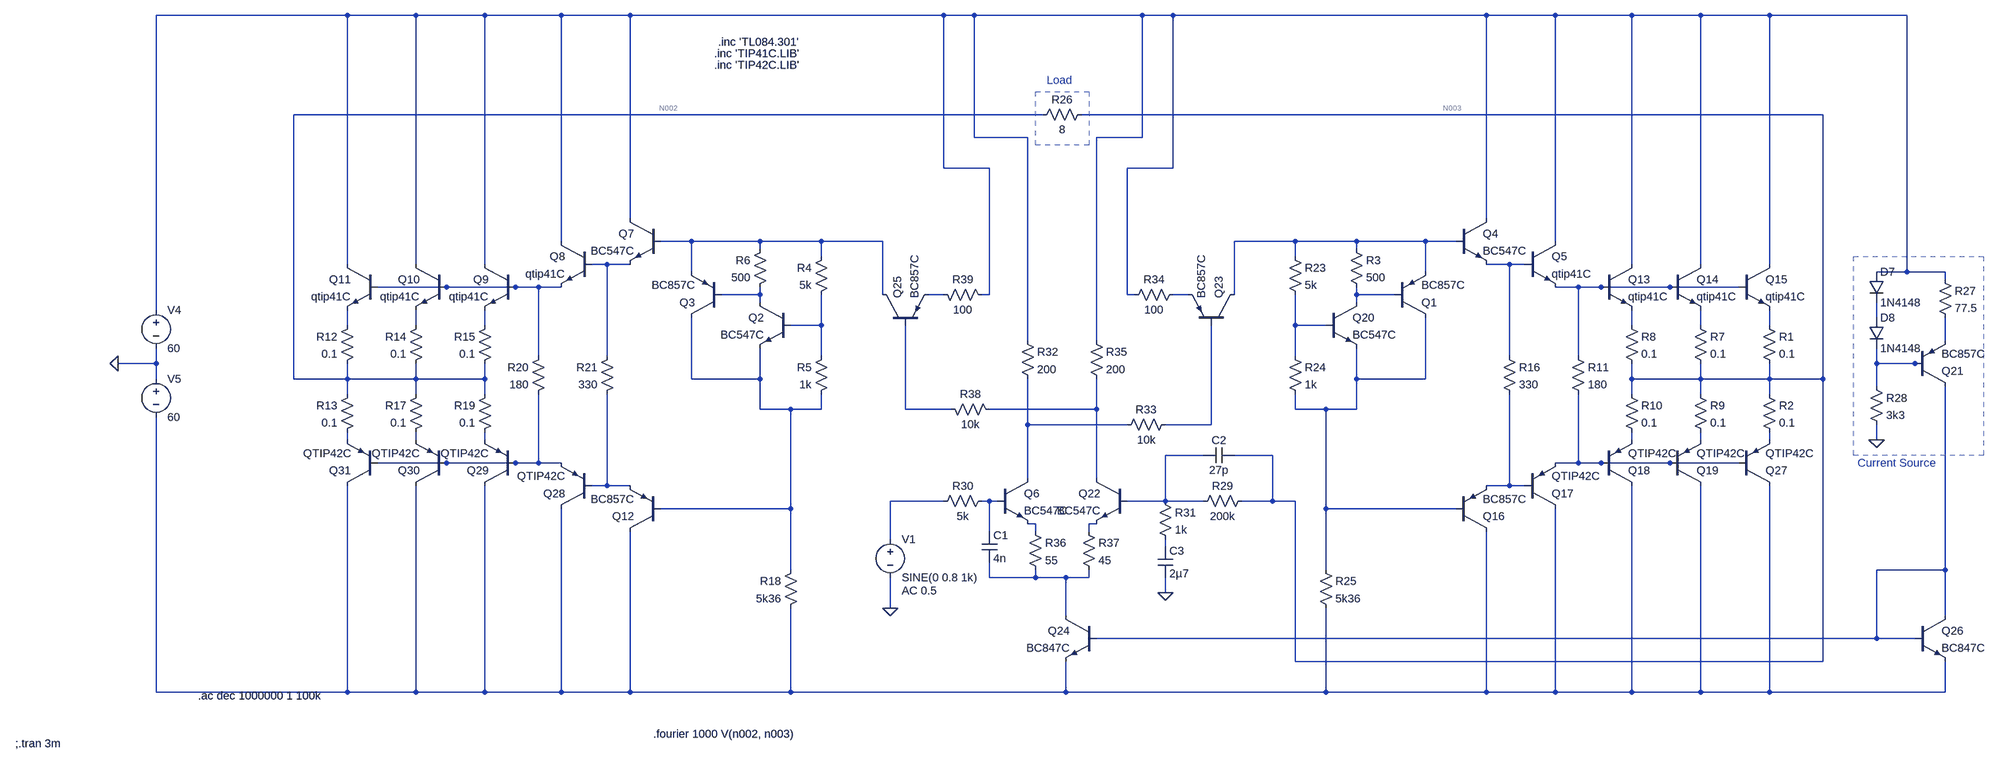
[diagram p0: schematic V3.asc]
V3.asc, the LTspice schematic file:
Version 4
SHEET 1 2416 748
WIRE -1344 -800 -1744 -800
WIRE -1200 -800 -1344 -800
WIRE -1056 -800 -1200 -800
WIRE -896 -800 -1056 -800
WIRE -752 -800 -896 -800
WIRE -96 -800 -752 -800
WIRE -32 -800 -96 -800
WIRE 320 -800 -32 -800
WIRE 384 -800 320 -800
WIRE 1040 -800 384 -800
WIRE 1184 -800 1040 -800
WIRE 1344 -800 1184 -800
WIRE 1488 -800 1344 -800
WIRE 1632 -800 1488 -800
WIRE 1920 -800 1632 -800
WIRE 112 -592 -1456 -592
WIRE 1744 -592 192 -592
WIRE -32 -544 -32 -800
WIRE 80 -544 -32 -544
WIRE 320 -544 320 -800
WIRE 320 -544 224 -544
WIRE -96 -480 -96 -800
WIRE 0 -480 -96 -480
WIRE 384 -480 384 -800
WIRE 384 -480 288 -480
WIRE -752 -368 -752 -800
WIRE 1040 -368 1040 -800
WIRE -896 -320 -896 -800
WIRE -624 -320 -688 -320
WIRE -480 -320 -624 -320
WIRE -352 -320 -480 -320
WIRE -224 -320 -352 -320
WIRE 640 -320 512 -320
WIRE 768 -320 640 -320
WIRE 912 -320 768 -320
WIRE 976 -320 912 -320
WIRE 1184 -320 1184 -800
WIRE -480 -304 -480 -320
WIRE 768 -304 768 -320
WIRE -352 -288 -352 -320
WIRE 640 -288 640 -320
WIRE -1344 -272 -1344 -800
WIRE -1200 -272 -1200 -800
WIRE -1056 -272 -1056 -800
WIRE -800 -272 -832 -272
WIRE -752 -272 -800 -272
WIRE 1088 -272 1040 -272
WIRE 1120 -272 1088 -272
WIRE 1344 -272 1344 -800
WIRE 1488 -272 1488 -800
WIRE 1632 -272 1632 -800
WIRE -624 -256 -624 -320
WIRE 912 -256 912 -320
WIRE 1920 -256 1920 -800
WIRE 1920 -256 1856 -256
WIRE 2000 -256 1920 -256
WIRE 2000 -240 2000 -256
WIRE -1136 -224 -1280 -224
WIRE -992 -224 -1136 -224
WIRE -944 -224 -992 -224
WIRE -896 -224 -944 -224
WIRE 1232 -224 1184 -224
WIRE 1280 -224 1232 -224
WIRE 1424 -224 1280 -224
WIRE 1568 -224 1424 -224
WIRE -480 -208 -480 -224
WIRE -480 -208 -560 -208
WIRE -224 -208 -224 -320
WIRE -96 -208 -128 -208
WIRE 0 -208 0 -480
WIRE 0 -208 -16 -208
WIRE 288 -208 288 -480
WIRE 304 -208 288 -208
WIRE 416 -208 384 -208
WIRE 512 -208 512 -320
WIRE 768 -208 768 -224
WIRE 848 -208 768 -208
WIRE -480 -192 -480 -208
WIRE 768 -192 768 -208
WIRE -1744 -176 -1744 -800
WIRE 1856 -160 1856 -192
WIRE -1344 -144 -1344 -176
WIRE -1200 -144 -1200 -176
WIRE -1056 -144 -1056 -176
WIRE -352 -144 -352 -208
WIRE -352 -144 -416 -144
WIRE 640 -144 640 -208
WIRE 704 -144 640 -144
WIRE 1344 -144 1344 -176
WIRE 1488 -144 1488 -176
WIRE 1632 -144 1632 -176
WIRE 80 -112 80 -544
WIRE 224 -112 224 -544
WIRE 2000 -112 2000 -160
WIRE -944 -80 -944 -224
WIRE -800 -80 -800 -272
WIRE -352 -80 -352 -144
WIRE 640 -80 640 -144
WIRE 1088 -80 1088 -272
WIRE 1232 -80 1232 -224
WIRE -1744 -64 -1744 -96
WIRE -1744 -64 -1824 -64
WIRE 1856 -64 1856 -96
WIRE 1936 -64 1856 -64
WIRE 1952 -64 1936 -64
WIRE -1744 -32 -1744 -64
WIRE -1456 -32 -1456 -592
WIRE -1344 -32 -1344 -64
WIRE -1344 -32 -1456 -32
WIRE -1200 -32 -1200 -64
WIRE -1200 -32 -1344 -32
WIRE -1056 -32 -1056 -64
WIRE -1056 -32 -1200 -32
WIRE -624 -32 -624 -160
WIRE -480 -32 -480 -96
WIRE -480 -32 -624 -32
WIRE 768 -32 768 -96
WIRE 912 -32 912 -160
WIRE 912 -32 768 -32
WIRE 1344 -32 1344 -64
WIRE 1488 -32 1488 -64
WIRE 1488 -32 1344 -32
WIRE 1632 -32 1632 -64
WIRE 1632 -32 1488 -32
WIRE 1744 -32 1744 -592
WIRE 1744 -32 1632 -32
WIRE 1856 -16 1856 -64
WIRE -1344 0 -1344 -32
WIRE -1200 0 -1200 -32
WIRE -1056 0 -1056 -32
WIRE 1344 0 1344 -32
WIRE 1488 0 1488 -32
WIRE 1632 0 1632 -32
WIRE -480 32 -480 -32
WIRE -416 32 -480 32
WIRE -352 32 -352 0
WIRE -352 32 -416 32
WIRE -176 32 -176 -144
WIRE -80 32 -176 32
WIRE 224 32 224 -32
WIRE 224 32 0 32
WIRE 640 32 640 0
WIRE 704 32 640 32
WIRE 768 32 768 -32
WIRE 768 32 704 32
WIRE 80 64 80 -32
WIRE 288 64 80 64
WIRE 464 64 464 -144
WIRE 464 64 368 64
WIRE -1344 96 -1344 80
WIRE -1200 96 -1200 80
WIRE -1056 96 -1056 80
WIRE 1344 96 1344 80
WIRE 1488 96 1488 80
WIRE 1632 96 1632 80
WIRE 1856 96 1856 64
WIRE 448 128 368 128
WIRE 592 128 512 128
WIRE -1136 144 -1280 144
WIRE -992 144 -1136 144
WIRE -944 144 -944 0
WIRE -944 144 -992 144
WIRE -896 144 -944 144
WIRE 1232 144 1232 0
WIRE 1232 144 1184 144
WIRE 1280 144 1232 144
WIRE 1424 144 1280 144
WIRE 1568 144 1424 144
WIRE 80 176 80 64
WIRE 224 176 224 32
WIRE -800 192 -800 0
WIRE -800 192 -832 192
WIRE -752 192 -800 192
WIRE 1088 192 1088 0
WIRE 1088 192 1040 192
WIRE 1120 192 1088 192
WIRE -96 224 -208 224
WIRE 0 224 -16 224
WIRE 16 224 0 224
WIRE 368 224 368 128
WIRE 368 224 288 224
WIRE 448 224 368 224
WIRE 592 224 592 128
WIRE 592 224 528 224
WIRE 640 224 592 224
WIRE -416 240 -416 32
WIRE -416 240 -688 240
WIRE 704 240 704 32
WIRE 976 240 704 240
WIRE 96 272 80 272
WIRE 224 272 208 272
WIRE 0 288 0 224
WIRE 96 288 96 272
WIRE 208 288 208 272
WIRE -208 304 -208 224
WIRE 368 320 368 304
WIRE -416 368 -416 240
WIRE 704 368 704 240
WIRE 2000 368 2000 -16
WIRE 2000 368 1856 368
WIRE 0 384 0 352
WIRE 96 384 96 368
WIRE 96 384 0 384
WIRE 160 384 96 384
WIRE 208 384 208 368
WIRE 208 384 160 384
WIRE 368 416 368 384
WIRE -208 448 -208 384
WIRE 160 464 160 384
WIRE 2000 464 2000 368
WIRE 1856 512 1856 368
WIRE 1856 512 224 512
WIRE 1936 512 1856 512
WIRE 640 560 640 224
WIRE 1744 560 1744 -32
WIRE 1744 560 640 560
WIRE -1744 624 -1744 48
WIRE -1344 624 -1344 192
WIRE -1344 624 -1744 624
WIRE -1200 624 -1200 192
WIRE -1200 624 -1344 624
WIRE -1056 624 -1056 192
WIRE -1056 624 -1200 624
WIRE -896 624 -896 240
WIRE -896 624 -1056 624
WIRE -752 624 -752 288
WIRE -752 624 -896 624
WIRE -416 624 -416 448
WIRE -416 624 -752 624
WIRE 160 624 160 560
WIRE 160 624 -416 624
WIRE 704 624 704 448
WIRE 704 624 160 624
WIRE 1040 624 1040 288
WIRE 1040 624 704 624
WIRE 1184 624 1184 240
WIRE 1184 624 1040 624
WIRE 1344 624 1344 192
WIRE 1344 624 1184 624
WIRE 1488 624 1488 192
WIRE 1488 624 1344 624
WIRE 1632 624 1632 192
WIRE 1632 624 1488 624
WIRE 2000 624 2000 560
WIRE 2000 624 1632 624
FLAG 1856 96 0
FLAG -1824 -64 0
FLAG -208 448 0
FLAG 368 416 0
SYMBOL res -400 352 M0
SYMATTR InstName R18
SYMATTR Value 5k36
SYMBOL npn 704 -192 R0
SYMATTR InstName Q20
SYMATTR Value BC547C
SYMBOL res 624 -304 R0
SYMATTR InstName R23
SYMATTR Value 5k
SYMBOL res 624 -96 R0
SYMATTR InstName R24
SYMATTR Value 1k
SYMBOL res 688 352 R0
SYMATTR InstName R25
SYMATTR Value 5k36
SYMBOL res 208 -608 R90
WINDOW 0 0 56 VBottom 2
WINDOW 3 32 56 VTop 2
SYMATTR InstName R26
SYMATTR Value 8
SYMBOL pnp 1936 -16 M180
SYMATTR InstName Q21
SYMATTR Value BC857C
SYMBOL res 1984 -256 R0
SYMATTR InstName R27
SYMATTR Value 77.5
SYMBOL res 1840 -32 R0
SYMATTR InstName R28
SYMATTR Value 3k3
SYMBOL diode 1840 -256 R0
SYMATTR InstName D7
SYMATTR Value 1N4148
SYMBOL diode 1840 -160 R0
SYMATTR InstName D8
SYMATTR Value 1N4148
SYMBOL voltage -1744 -192 R0
WINDOW 123 0 0 Left 0
WINDOW 39 24 44 Left 2
SYMATTR InstName V4
SYMATTR Value 60
SYMBOL voltage -1744 -48 R0
WINDOW 123 0 0 Left 0
WINDOW 39 24 124 Left 2
SYMATTR InstName V5
SYMATTR Value 60
SYMBOL npn 16 176 R0
SYMATTR InstName Q6
SYMATTR Value BC547C
SYMBOL npn 288 176 M0
SYMATTR InstName Q22
SYMATTR Value BC547C
SYMBOL res 544 208 R90
WINDOW 0 0 56 VBottom 2
WINDOW 3 32 56 VTop 2
SYMATTR InstName R29
SYMATTR Value 200k
SYMBOL res 0 208 R90
WINDOW 0 0 56 VBottom 2
WINDOW 3 32 56 VTop 2
SYMATTR InstName R30
SYMATTR Value 5k
SYMBOL res 352 208 R0
SYMATTR InstName R31
SYMATTR Value 1k
SYMBOL res 64 -128 R0
SYMATTR InstName R32
SYMATTR Value 200
SYMBOL pnp 512 -144 M270
SYMATTR InstName Q23
SYMATTR Value BC857C
SYMBOL res 384 48 R90
WINDOW 0 0 56 VBottom 2
WINDOW 3 32 56 VTop 2
SYMATTR InstName R33
SYMATTR Value 10k
SYMBOL res 288 -192 R270
WINDOW 0 32 56 VTop 2
WINDOW 3 0 56 VBottom 2
SYMATTR InstName R34
SYMATTR Value 100
SYMBOL npn 224 464 M0
SYMATTR InstName Q24
SYMATTR Value BC847C
SYMBOL res 208 -128 R0
SYMATTR InstName R35
SYMATTR Value 200
SYMBOL res 80 272 R0
SYMATTR InstName R36
SYMATTR Value 55
SYMBOL res 192 272 R0
SYMATTR InstName R37
SYMATTR Value 45
SYMBOL voltage -208 288 R0
WINDOW 123 24 124 Left 2
WINDOW 39 0 0 Left 0
SYMATTR Value2 AC 0.5
SYMATTR InstName V1
SYMATTR Value SINE(0 0.8 1k)
SYMBOL pnp -224 -144 R270
SYMATTR InstName Q25
SYMATTR Value BC857C
SYMBOL res -96 16 M90
WINDOW 0 0 56 VBottom 2
WINDOW 3 32 56 VTop 2
SYMATTR InstName R38
SYMATTR Value 10k
SYMBOL res 0 -192 M270
WINDOW 0 32 56 VTop 2
WINDOW 3 0 56 VBottom 2
SYMATTR InstName R39
SYMATTR Value 100
SYMBOL npn 1936 464 R0
SYMATTR InstName Q26
SYMATTR Value BC847C
SYMBOL cap -16 288 R0
SYMATTR InstName C1
SYMATTR Value 4n
SYMBOL cap 512 112 R90
WINDOW 0 0 32 VBottom 2
WINDOW 3 32 32 VTop 2
SYMATTR InstName C2
SYMATTR Value 27p
SYMBOL cap 352 320 R0
SYMATTR InstName C3
SYMATTR Value 2µ7
SYMBOL res 752 -320 R0
SYMATTR InstName R3
SYMATTR Value 500
SYMBOL pnp 848 -160 M180
SYMATTR InstName Q1
SYMATTR Value BC857C
SYMBOL npn -416 -192 M0
SYMATTR InstName Q2
SYMATTR Value BC547C
SYMBOL res -336 -304 M0
SYMATTR InstName R4
SYMATTR Value 5k
SYMBOL res -336 -96 M0
SYMATTR InstName R5
SYMATTR Value 1k
SYMBOL res -464 -320 M0
SYMATTR InstName R6
SYMATTR Value 500
SYMBOL pnp -560 -160 R180
SYMATTR InstName Q3
SYMATTR Value BC857C
SYMBOL npn 976 -368 R0
SYMATTR InstName Q4
SYMATTR Value BC547C
SYMBOL npn 1120 -320 R0
SYMATTR InstName Q5
SYMATTR Value qtip41C
SYMBOL npn 1280 -272 R0
SYMATTR InstName Q13
SYMATTR Value qtip41C
SYMBOL npn 1424 -272 R0
SYMATTR InstName Q14
SYMATTR Value qtip41C
SYMBOL npn 1568 -272 R0
SYMATTR InstName Q15
SYMATTR Value qtip41C
SYMBOL pnp 976 288 M180
SYMATTR InstName Q16
SYMATTR Value BC857C
SYMBOL pnp 1120 240 M180
SYMATTR InstName Q17
SYMATTR Value QTIP42C
SYMBOL pnp 1280 192 M180
SYMATTR InstName Q18
SYMATTR Value QTIP42C
SYMBOL pnp 1424 192 M180
SYMATTR InstName Q19
SYMATTR Value QTIP42C
SYMBOL pnp 1568 192 M180
SYMATTR InstName Q27
SYMATTR Value QTIP42C
SYMBOL res 1616 -160 R0
SYMATTR InstName R1
SYMATTR Value 0.1
SYMBOL res 1616 -16 R0
SYMATTR InstName R2
SYMATTR Value 0.1
SYMBOL res 1472 -160 R0
SYMATTR InstName R7
SYMATTR Value 0.1
SYMBOL res 1328 -160 R0
SYMATTR InstName R8
SYMATTR Value 0.1
SYMBOL res 1472 -16 R0
SYMATTR InstName R9
SYMATTR Value 0.1
SYMBOL res 1328 -16 R0
SYMATTR InstName R10
SYMATTR Value 0.1
SYMBOL res 1216 -96 R0
SYMATTR InstName R11
SYMATTR Value 180
SYMBOL res 1072 -96 R0
SYMATTR InstName R16
SYMATTR Value 330
SYMBOL npn -688 -368 M0
SYMATTR InstName Q7
SYMATTR Value BC547C
SYMBOL npn -832 -320 M0
SYMATTR InstName Q8
SYMATTR Value qtip41C
SYMBOL npn -992 -272 M0
SYMATTR InstName Q9
SYMATTR Value qtip41C
SYMBOL npn -1136 -272 M0
SYMATTR InstName Q10
SYMATTR Value qtip41C
SYMBOL npn -1280 -272 M0
SYMATTR InstName Q11
SYMATTR Value qtip41C
SYMBOL pnp -688 288 R180
SYMATTR InstName Q12
SYMATTR Value BC857C
SYMBOL pnp -832 240 R180
SYMATTR InstName Q28
SYMATTR Value QTIP42C
SYMBOL pnp -992 192 R180
SYMATTR InstName Q29
SYMATTR Value QTIP42C
SYMBOL pnp -1136 192 R180
SYMATTR InstName Q30
SYMATTR Value QTIP42C
SYMBOL pnp -1280 192 R180
SYMATTR InstName Q31
SYMATTR Value QTIP42C
SYMBOL res -1328 -160 M0
SYMATTR InstName R12
SYMATTR Value 0.1
SYMBOL res -1328 -16 M0
SYMATTR InstName R13
SYMATTR Value 0.1
SYMBOL res -1184 -160 M0
SYMATTR InstName R14
SYMATTR Value 0.1
SYMBOL res -1040 -160 M0
SYMATTR InstName R15
SYMATTR Value 0.1
SYMBOL res -1184 -16 M0
SYMATTR InstName R17
SYMATTR Value 0.1
SYMBOL res -1040 -16 M0
SYMATTR InstName R19
SYMATTR Value 0.1
SYMBOL res -928 -96 M0
SYMATTR InstName R20
SYMATTR Value 180
SYMBOL res -784 -96 M0
SYMATTR InstName R21
SYMATTR Value 330
TEXT -568 -744 Left 2 !.inc 'TL084.301'
TEXT 1816 144 Left 2 ;Current Source
TEXT -576 -720 Left 2 !.inc 'TIP41C.LIB'
TEXT -1656 632 Left 2 !.ac dec 1000000 1 100k
TEXT -704 712 Left 2 !.fourier 1000 V(n002, n003)
TEXT -2122 732 Left 2 !;.tran 3m
TEXT -576 -696 Left 2 !.inc 'TIP42C.LIB'
TEXT 120 -664 Left 2 ;Load
RECTANGLE Normal 2080 128 1808 -288 2
RECTANGLE Normal 208 -528 96 -640 2

The netlist it stands for:
* V3.asc
R18 N025 N049 5k36
Q20 N013 N019 N026 0 BC547C
R23 N005 N019 5k
R24 N019 N026 1k
R25 N026 N049 5k36
R26 N003 N002 8
Q21 N047 N024 N023 0 BC857C
R27 N001 N023 77.5
R28 N024 0 3k3
D7 N001 N014 1N4148
D8 N014 N024 1N4148
V4 N001 0 60
V5 0 N049 60
Q6 N029 N043 N044 0 BC547C
Q22 N028 N037 N045 0 BC547C
R29 N003 N037 200k
R30 N043 N042 5k
R31 N037 N046 1k
R32 N001 N029 200
Q23 N005 N030 N012 0 BC857C
R33 N030 N029 10k
R34 N001 N012 100
Q24 N048 N047 N049 0 BC847C
R35 N001 N028 200
R36 N044 N048 55
R37 N045 N048 45
V1 N042 0 SINE(0 0.8 1k) AC 0.5
Q25 N004 N027 N011 0 BC857C
R38 N027 N028 10k
R39 N001 N011 100
Q26 N047 N047 N049 0 BC847C
C1 N043 N048 4n
C2 N003 N037 27p
C3 N046 0 2µ7
R3 N005 N013 500
Q1 N026 N013 N005 0 BC857C
Q2 N010 N018 N025 0 BC547C
R4 N004 N018 5k
R5 N018 N025 1k
R6 N004 N010 500
Q3 N025 N010 N004 0 BC857C
Q4 N001 N005 N007 0 BC547C
Q5 N001 N007 N009 0 qtip41C
Q13 N001 N009 N020 0 qtip41C
Q14 N001 N009 N021 0 qtip41C
Q15 N001 N009 N022 0 qtip41C
Q16 N049 N026 N041 0 BC857C
Q17 N049 N041 N039 0 QTIP42C
Q18 N049 N039 N034 0 QTIP42C
Q19 N049 N039 N035 0 QTIP42C
Q27 N049 N039 N036 0 QTIP42C
R1 N022 N003 0.1
R2 N003 N036 0.1
R7 N021 N003 0.1
R8 N020 N003 0.1
R9 N003 N035 0.1
R10 N003 N034 0.1
R11 N009 N039 180
R16 N007 N041 330
Q7 N001 N004 N006 0 BC547C
Q8 N001 N006 N008 0 qtip41C
Q9 N001 N008 N017 0 qtip41C
Q10 N001 N008 N016 0 qtip41C
Q11 N001 N008 N015 0 qtip41C
Q12 N049 N025 N040 0 BC857C
Q28 N049 N040 N038 0 QTIP42C
Q29 N049 N038 N033 0 QTIP42C
Q30 N049 N038 N032 0 QTIP42C
Q31 N049 N038 N031 0 QTIP42C
R12 N015 N002 0.1
R13 N002 N031 0.1
R14 N016 N002 0.1
R15 N017 N002 0.1
R17 N002 N032 0.1
R19 N002 N033 0.1
R20 N008 N038 180
R21 N006 N040 330
.model D D
.lib standard.dio
.model NPN NPN
.model PNP PNP
.lib standard.bjt
.inc 'TL084.301'
* Current Source
.inc 'TIP41C.LIB'
.ac dec 1000000 1 100k
.fourier 1000 V(n002, n003)
;.tran 3m
.inc 'TIP42C.LIB'
* Load
.backanno
.end